# Altium schematic sheet POWER_REV2.SchDoc
size A4; SheetNumber: 3; SheetTotal: 11; SPICEModelCacheNVXGRYFH: <root> / <DocumentId>NVXGRYFH</DocumentId> / </root>
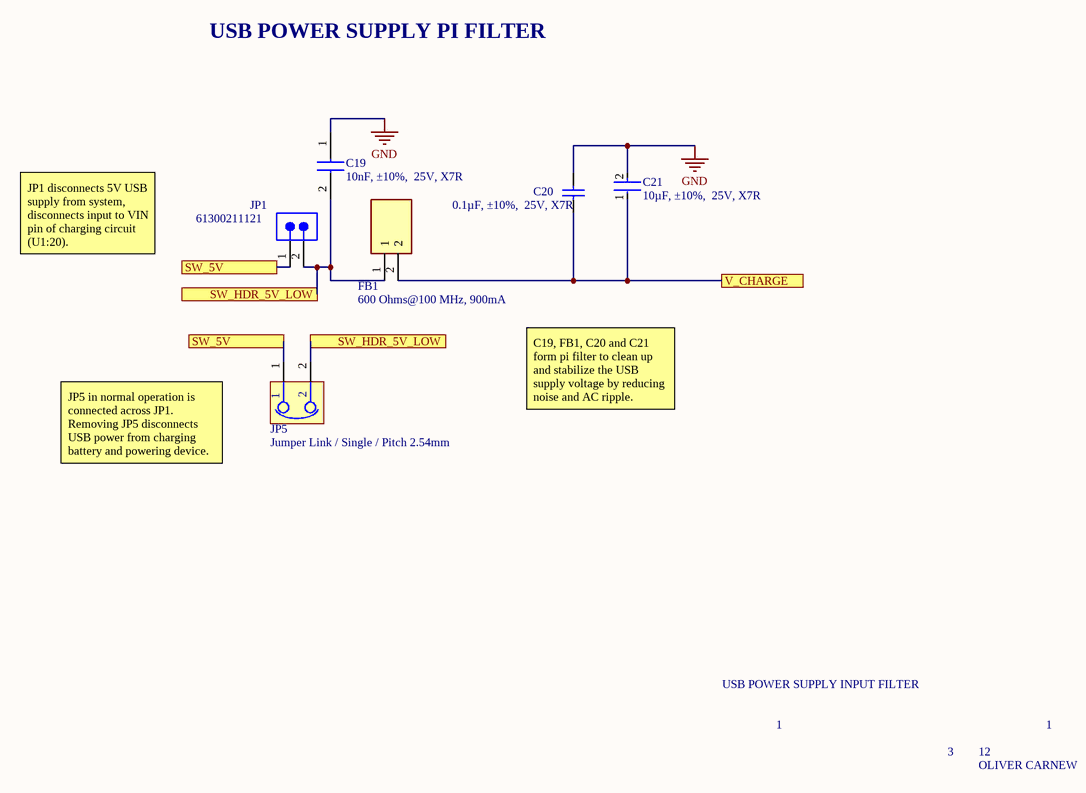
[diagram p0: POWER_REV2.SchDoc]

## Parts
C19  10nF, ±10%,  25V, X7R  [C0603]
C20  0.1µF, ±10%,  25V, X7R  [CAPC1608X90X35ML10T15]
C21  10µF, ±10%,  25V, X7R  [FP-CL21B106KOQNNNE-MFG]
FB1  600 Ohms@100 MHz, 900mA  [BEADC1608X90N]
JP1  61300211121  [61300211121]
JP5  Jumper Link / Single / Pitch 2.54mm

## Ports
SW_5V, SW_HDR_5V_LOW, V_CHARGE

## Nets
GND: C19.1 C20.2 C21.2
SW_5V: JP1.1 JP5.1 ; port SW_5V
SW_HDR_5V_LOW: C19.2 FB1.1 JP1.2 JP5.2 ; port SW_HDR_5V_LOW
V_CHARGE: C20.1 C21.1 FB1.2 ; port V_CHARGE

## Notes on the sheet
- USB POWER SUPPLY PI FILTER
- JP1 disconnects 5V USB supply from system, disconnects input to VIN pin of charging circuit (U1:20).
- C19, FB1, C20 and C21 form pi filter to clean up and stabilize the USB supply voltage by reducing noise and AC ripple.
- JP5 in normal operation is connected across JP1. Removing JP5 disconnects USB power from charging battery and powering device.
- USB POWER SUPPLY INPUT FILTER
- 1
- 3
- 12
- OLIVER CARNEW

## Library data of the parts
C19 = C0603C103K4RECTU: Capacitor 10000 pF ±10% 16V Ceramic Capacitor X7R 0603 (1608 Metric) ETSG 64-12-01 C0603C103K4RECTU; Manufacturer_Name: KEMET; Datasheet Link: https://content.kemet.com/datasheets/KEM_C1090_X7R_ESD.pdf; Height: 0.87mm; Manufacturer_Part_Number: C0603C103K4RECTU; Mouser Part Number: 80-C0603C103K4RECTU; Mouser Price/Stock: https://www.mouser.co.uk/ProductDetail/KEMET/C0603C103K4RECTU?qs=55YtniHzbhDzGaFFpCm8vg%3D%3D; Arrow Part Number: C0603C103K4RECTU; Arrow Price/Stock: https://www.arrow.com/en/products/c0603c103k4rectu/kemet-corporation?region=nac
C20 = CMP-2100-03643-1: Chip Capacitor, 0.1 uF, +/- 10%, 50 V, -55 to 125 degC, 0603 (1608 Metric), RoHS, Tape and Reel; Manufacturer: Murata; Dielectric Material: Ceramic; Voltage Rating: 50V; Capacitance: 100nF; Insulation Resistance: 10GR; Case Code (Metric): 1608; Lead Free: LeadFree; Depth: 0.8mm; Number of Pins: 2; Radiation Hardening: No; Case/Package: 0603; Manufacturer URL: http://www.murata.com/; Packaging: TapeandReel; Length: 1.6mm; Contact Plating: Tin; Datasheet URL: http://psearch.en.murata.com/capacitor/product/GRM188R71H104KA93%23.pdf; Tolerance: 10%; Case Code (Imperial): 0603; Min Operating Temperature: -55degC; RoHSCompliant: true; Voltage: 50V; Termination: SMD/SMT; Mount: SurfaceMount; Material: Ceramic; Package Quantity: 1; Dielectric: X7R; Height: 0.8mm; Thickness: 0.035inch; REACH SVHC: NoSVHC; Max Operating Temperature: 125degC; Width: 0.8mm; Package Reference: 0603; Voltage Rating (DC): 50V; Datasheet Version: 42675.0; Package Description: 2-Pin Surface Mount Device, Body 1.6 x 0.8 mm
C21 = CMP-2000-06106-2: CAP CER 10UF 16V X7R 0805 CL21B106KOQNNNE; Manufacturer: Samsung Electro-Mechanics America, Inc; Material: Ceramic; Temperature Coefficient: 15%; Digikey Description: CAP CER 10UF 16V X7R 0805; Lead Free: Yes; ComponentLink2URL: http://www.samsungsem.com/servlet/FileDownload?path=productsearch&sname=CL21B106KOQNNNE.pdf&oname=CL21B106KOQNNNE.pdf; ComponentLink2Description: Datasheet; Temperature Range Low: -55°C; RoHS: TRUE; Category: Cap; Temperature Characteristic: X7R; Manufacturer Part Number: CL21B106KOQNNNE; Automotive: No; Octopart: https://octopart.com/cl21b106koqnnne-samsung-19832289; Device Class L3: Ceramic Capacitors; Temperature Range High: +125°C; Height: 1.4mm; Device Class L2: Capacitors; Voltage Rating: 16V; Value: 10uF; Temperature: -55°C to +125°C; Tolerance: 10%; Device Class L1: Passive Components; Ipc Land Pattern Name: CAPC200125X125; Package: CL21B106KOQNNNE; Capacitance: 10uF
FB1 = FBMH1608HM601-T: 600 Ohms @ 100 MHz 1 Power Line Ferrite Bead 0603 (1608 Metric) 900mA 170mOhm; Manufacturer_Name: TAIYO YUDEN; Datasheet Link: https://componentsearchengine.com/Datasheets/2/FBMH1608HM601-T.pdf; Height: 0.9mm; Manufacturer_Part_Number: FBMH1608HM601-T; Mouser Part Number: 963-FBMH1608HM601-T; Mouser Price/Stock: https://www.mouser.co.uk/ProductDetail/TAIYO-YUDEN/FBMH1608HM601-T?qs=I6KAKw0tg2y6O4cu0afp%252BA%3D%3D; Arrow Part Number: FBMH1608HM601-T; Arrow Price/Stock: https://www.arrow.com/en/products/fbmh1608hm601-t/taiyo-yuden
JP1 = CMP-1712-00002-6: NexarPartId: 20081794; Number of Contacts: 2; Pitch: 2.54mm; Connector Type: Male Pin; Voltage Rating: 250V; Current Rating: 3A; Gender: Male; Contact Resistance: 20mΩ; Height: 8.94mm; Lead Free: Lead Free; Number of Pins: 2; Termination: Through Hole; RoHS: Compliant; Lead Pitch: 2.54mm; REACH SVHC: No SVHC; Housing Material: PBT; Contact Mating Length: 5.9944mm; Min Operating Temperature: -40°C; Orientation: Vertical; Contact Material: Copper; Contact Gender: Male; Max Operating Temperature: 125°C; Number of Rows: 1; Number of Positions: 2; Packaging: Bulk; Contact Plating: Gold; Mount: Through Hole; Color: Black; Operating Supply Voltage: 250V
JP5 = jumper_2.54mm: CONNECTOR : PCB Jumper Link / Single / Pitch 2.54mm / Black /shunt.  01-96-02